# Altium project microSDAdaptor.PrjPcb
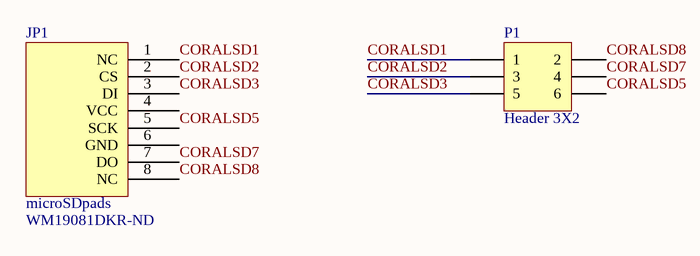
[diagram p0: microSDAdaptor.SchDoc]
1 sheet, 2 parts. Net scope: global (net labels, ports and power ports of the same name join across sheets).
Board file: microSDAdaptor.PcbDoc

## Sheet microSDAdaptor.SchDoc
size Legal; SheetNumber: 1; SheetTotal: 1

### Parts
JP1  microSDpads  Supplier Part Number 1: WM19081DKR-ND  [microSDtabs]
P1  Header 3X2  [HDR2X3]

### Nets
CORALSD1: JP1.1(NC) P1.1
CORALSD2: JP1.2(CS) P1.3
CORALSD3: JP1.3(DI) P1.5
CORALSD5: JP1.5(SCK) P1.6
CORALSD7: JP1.7(DO) P1.4
CORALSD8: JP1.8(NC) P1.2

Not connected (* = marked no-connect by the designer): JP1 4(VCC) 6(GND)

### Library data of the parts
P1 = Header 3X2: Header, 3-Pin, Dual row; LatestRevisionDate: 17-Jul-2002; LatestRevisionNote: Re-released for DXP Platform.; Publisher: Altium Limited
JP1 = microSDpads: Supplier 1: Digi-Key